# EasyEDA Pro project ProProject_高频电路震荡器_2024-07-08.epro

# Schematic Schematic1
Create Date: 2024-06-09; Page Name: P1; Project Name: 高频电路震荡器; Schematic Name: Schematic1; Update Date: 2024-06-09; Company: 嘉立创EDA; Page Size: A4; Version: V1.0
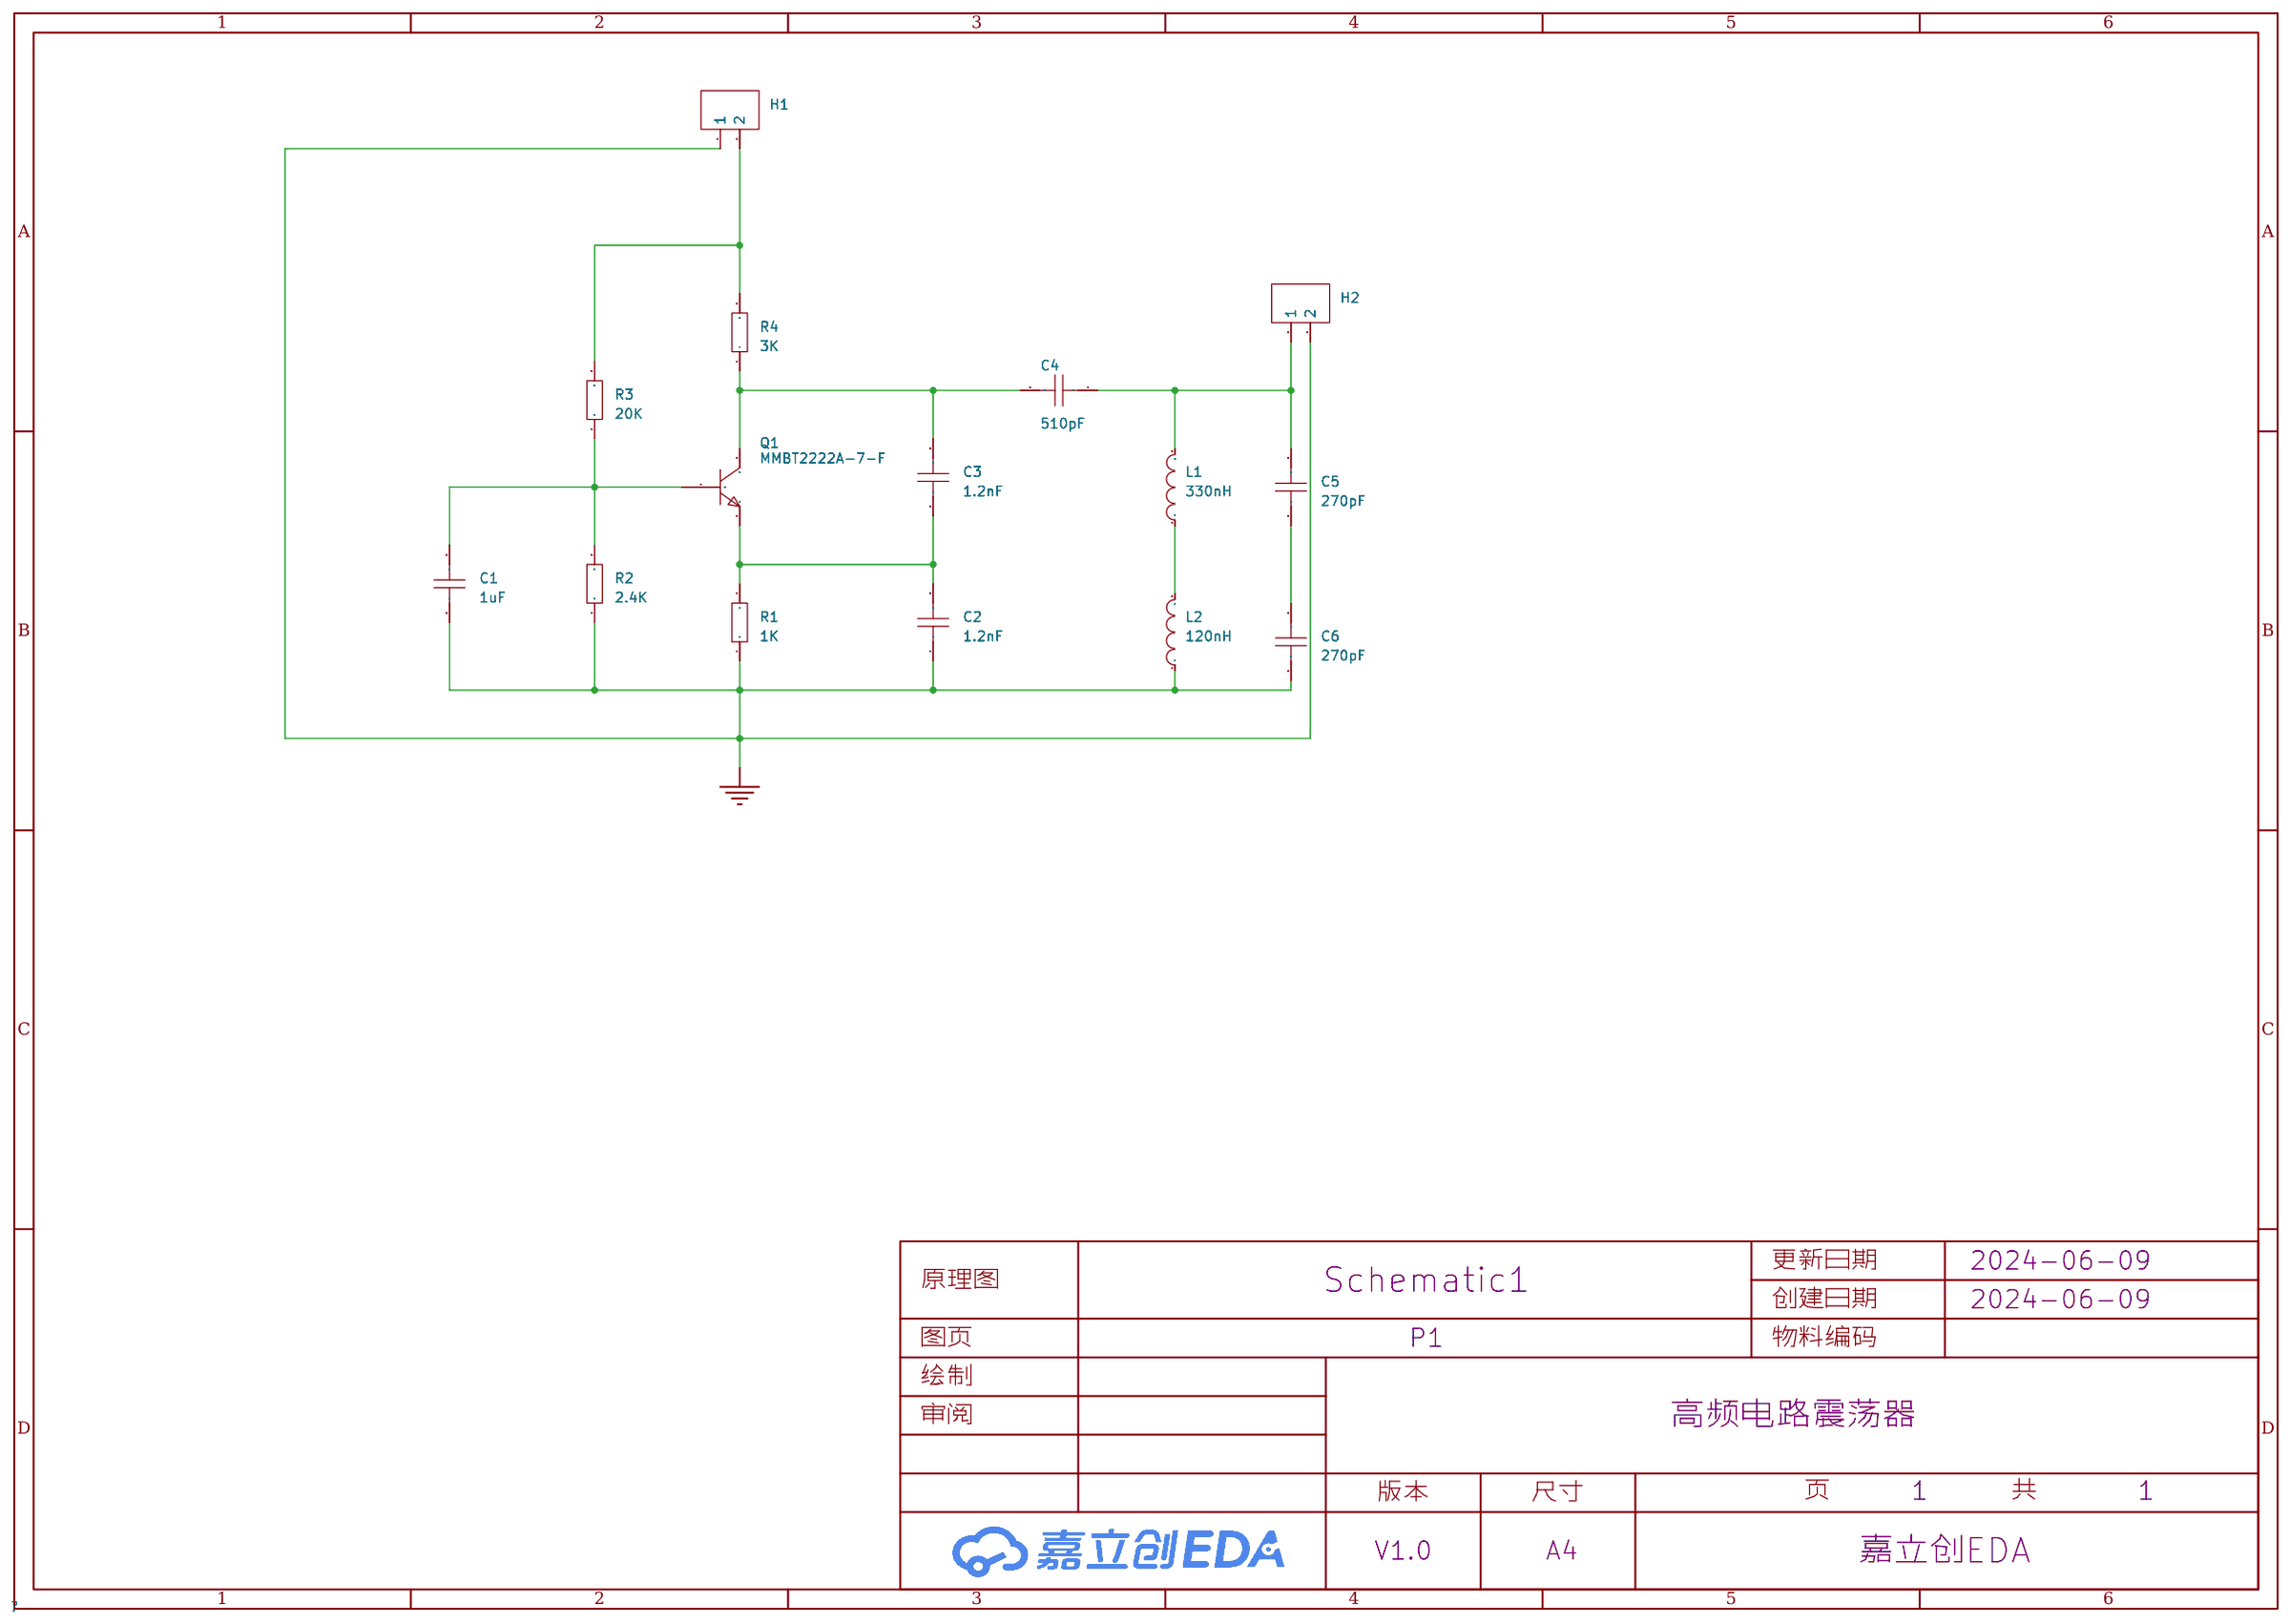
[diagram p0: schematic sheet]

## Parts
C1  1uF  [C0805]
C2  1.2nF  [C0805]
C3  1.2nF  [C0805]
C4  510pF  [C0805]
C5  270pF  [C0805]
C6  270pF  [C0805]
H1  -  [HDR-TH_2P-P2.54-V-F]
H2  -  [HDR-TH_2P-P2.54-V-F]
L1  330nH  [L0805]
L2  120nH  [L0805]
Q1  MMBT2222A-7-F  [SOT-23-3_L2.9-W1.6-P1.90-LS2.8-BR]
R1  1K  [R0805]
R2  2.4K  [R0805]
R3  20K  [R0805]
R4  3K  [R0805]

## Library data of the parts
C1-C6 = CAP_0805: Supplier Footprint: 0805
H1 H2 = HDR-F_2.54_1x2P: Supplier Part: C49661; Supplier Footprint: 插件
L1 L2 = L_0805
Q1 = MMBT2222A-7-F: 晶体管类型:NPN;集电极电流(Ic):600mA;集射极击穿电压(Vceo):40V;功率(Pd):310mW;直流电流增益(hFE@Ic,Vce):100@150mA,10V;; LCSC Part Name: 耐压:40V 电流:600mA NPN; Supplier Part: C94515; Manufacturer: DIODES(美台); Supplier Footprint: SOT-23; JLCPCB Part Class: 扩展库; Datasheet: https://atta.szlcsc.com/upload/public/pdf/source/20180307/C94515_15204091498191407767.pdf; Supplier: LCSC; Transistor Type: NPN; Collector Current (Ic): 600mA; Collector-Emitter Breakdown Voltage (Vceo): 40V; Power Dissipation (Pd): 310mW; DC Current Gain (hFE@Ic,Vce): 100@150mA,10V; Transition Frequency (fT): 300MHz; Collector Cut-Off Current (Icbo): 10nA; Collector-Emitter Saturation Voltage (VCE(sat)@Ic,Ib): 1V@500mA,50mA; Operating Temperature: -55℃~+150℃@(Tj)
R1-R4 = Res_0805: Supplier Footprint: 0805

## Nets
GND: C1.2 C2.1 C6.1 H1.1 H2.2 L2.1 R1.1 R2.1
Net-(C1-1): C1.1 Q1.1(B) R2.2 R3.1
Net-(C2-2): C2.2 C3.1 Q1.2(E) R1.2
Net-(C3-2): C3.2 C4.2 Q1.3(C) R4.1
Net-(C4-1): C4.1 C5.2 H2.1 L1.2
Net-(C5-1): C5.1 C6.2
Net-(H1-2): H1.2 R3.2 R4.2
Net-(L1-1): L1.1 L2.2

# Board PCB1
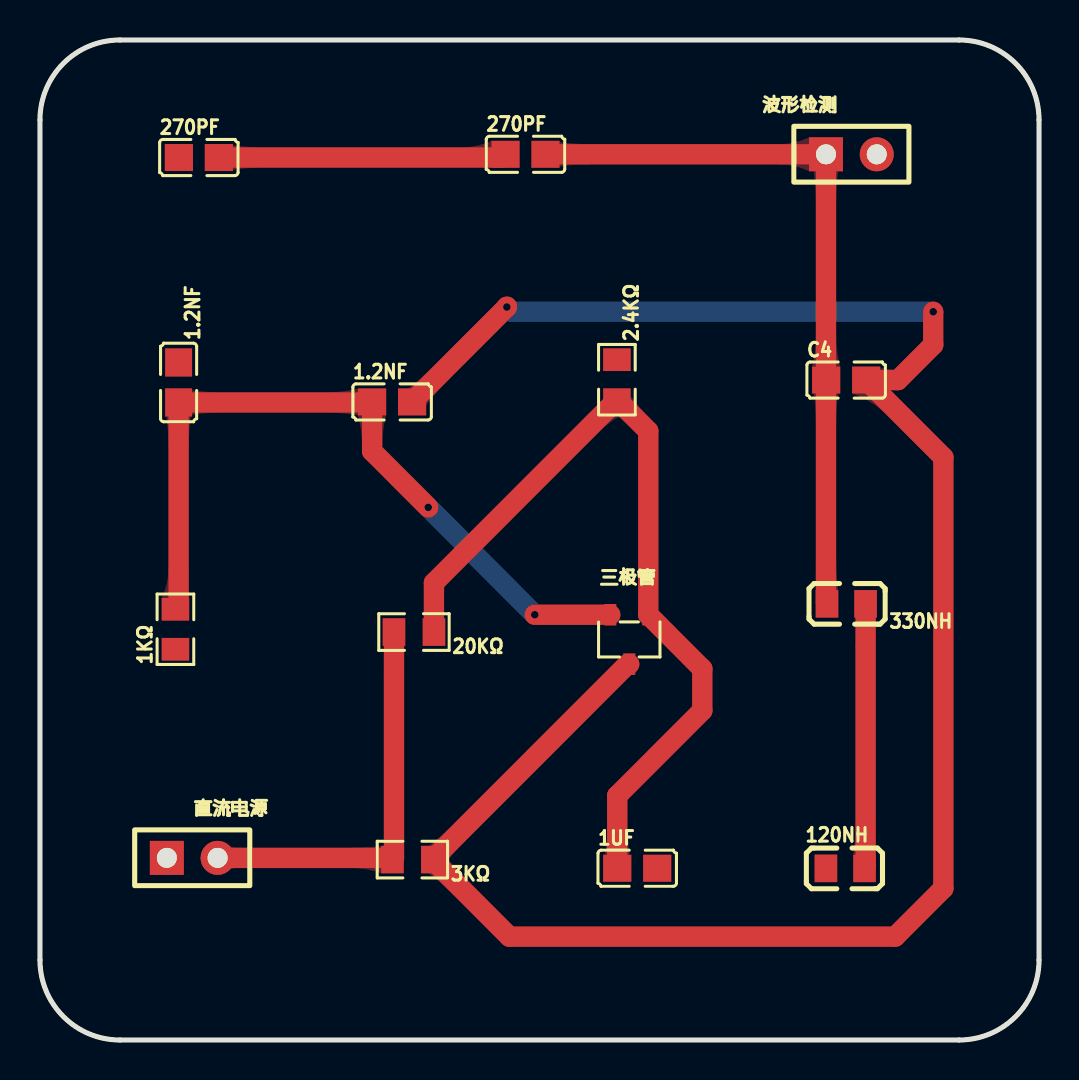
[diagram p1: board, top side]
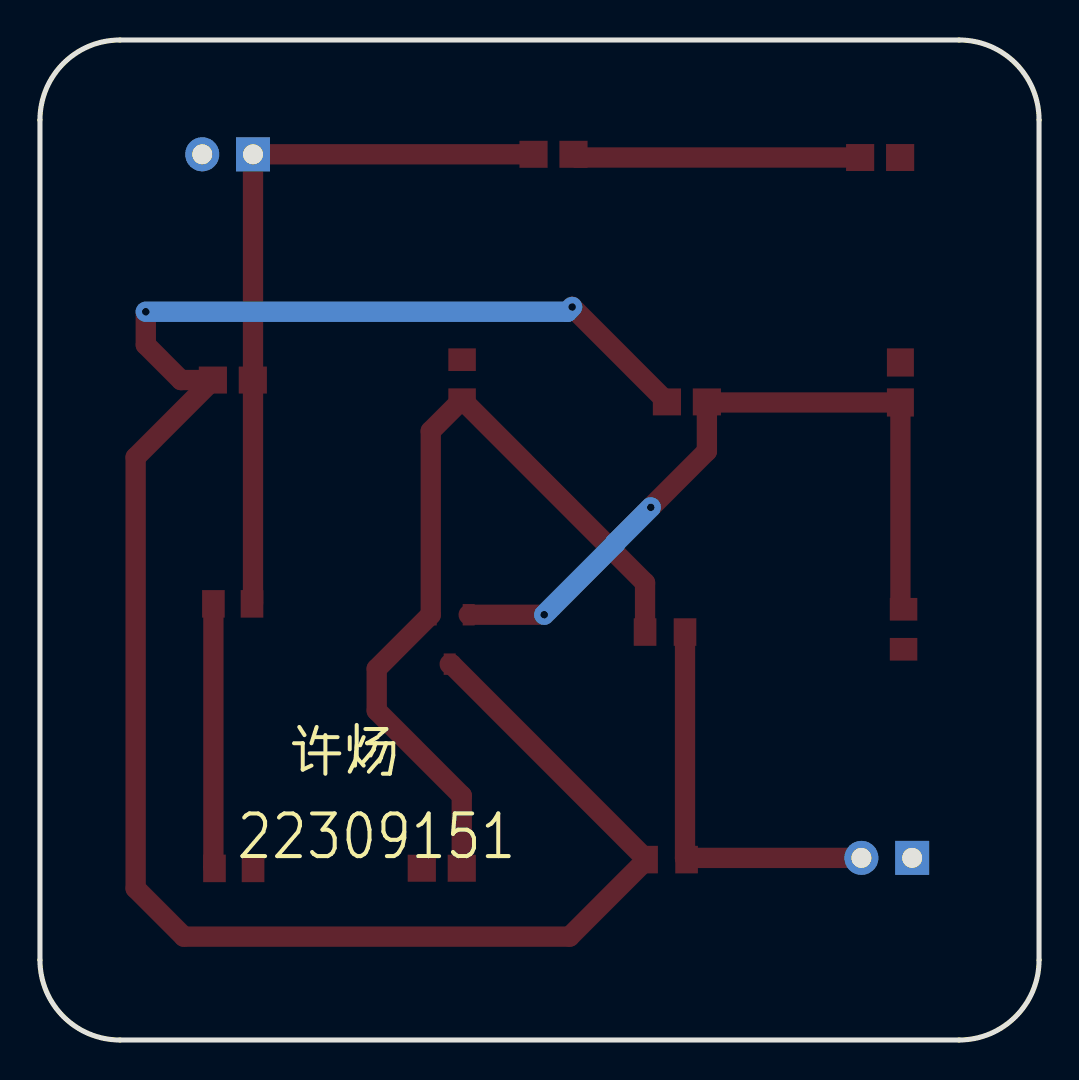
[diagram p2: board, bottom side, seen from below]

Outline 50 x 50 mm; copper layers: Top Layer, Bottom Layer. Coordinates in mm from the lower left corner of the outline.
Outline path: 0,46 0,4 arc(1.17,1.17) 4,0 46,0 arc(48.83,1.17) 50,4 50,46 arc(48.83,48.83) 46,50 4,50 arc(1.17,48.83) 0,46
Stack: Top Layer 0.035mm / Dielectric1 1.51mm FR4 er 4.5 / Bottom Layer 0.035mm

## Design rules (mm)
template: 自定义配置
spacing copperThickness1oz (default): track to track 0.102, other pairs 0.152 to 0.3
spacing copperThickness2oz: track to track 0.203, other pairs 0.152 to 0.3
track width copperThickness1oz (default): min 0.762, default 0.762, max 2.54
track width copperThickness2oz: min 0.203, default 0.254, max 2.54
differential pair differentialPair (default): width min 0.127, default 0.254, max 2.54; gap min 0.152, default 0.152
via viaSize (default): diameter min 0.5, default 0.61, max 10; hole min 0.3, default 0.305, max 6.299

## Placement (name value [footprint] x y rotation side)
1.2NF  -  [C0805]  17.62 31.9 0 top
1.2NF#2  -  [C0805]  6.94 32.88 270 top
1KΩ  1K  [R0805]  6.78 20.54 90 top
1UF  1uF  [C0805]  29.89 8.59 0 top
2.4KΩ  2.4K  [R0805]  28.87 33.02 270 top
3KΩ  3K  [R0805]  18.64 9.02 180 top
20KΩ  20K  [R0805]  18.72 20.4 180 top
120NH  120nH  [L0805]  40.3 8.58 0 top
270PF  -  [C0805]  24.3 44.29 0 top
270PF#2  -  [C0805]  7.95 44.12 0 top
330NH  330nH  [L0805]  40.35 21.81 180 top
C4  510pF  [C0805]  40.35 33 0 top
三极管  MMBT2222A-7-F  [SOT-23-3_L2.9-W1.6-P1.90-LS2.8-BR]  29.49 20.03 90 top
波形检测  -  [HDR-TH_2P-P2.54-V-F]  40.61 44.29 0 top
直流电源  -  [HDR-TH_2P-P2.54-V-F]  7.62 9.11 0 top

## Footprints (pads in the part's own frame, mm; a bottom-side part is the same pattern mirrored in y, then rotated)
C0805
  rect 1.41x1.35 smd: 1(-1,0) 2(1,0)
HDR-TH_2P-P2.54-V-F
  rect 1.7x1.7 hole 1: 1(-1.27,0)
  round 1.7 hole 1: 2(1.27,0)
L0805
  rect 1.133x1.377 smd: 1(-0.966,0) 2(0.966,0)
R0805
  rect 1.133x1.377 smd: 1(-1,0) 2(1,0)
SOT-23-3_L2.9-W1.6-P1.90-LS2.8-BR
  rect 1.07x0.6 smd: 1(1.235,-0.95) 2(1.235,0.95) 3(-1.235,0)

## Nets
GND: 1.2NF#2.1 1KΩ.1 1UF.2 2.4KΩ.1 120NH.1 270PF#2.1 波形检测.2 直流电源.1
$1N484: 120NH.2 330NH.1
$1N509: 270PF.1 270PF#2.2
$1N549: 1UF.1 2.4KΩ.2 20KΩ.1 三极管.1
$1N583: 1.2NF.2 3KΩ.1 C4.2 三极管.3
$1N694: 3KΩ.2 20KΩ.2 直流电源.2
$1N780: 270PF.2 330NH.2 C4.1 波形检测.1
$1N793: 1.2NF.1 1.2NF#2.2 1KΩ.2 三极管.2

## Via types
v1: diameter 0.762, hole 0.381, Top Layer to Bottom Layer, 4 vias

## Routing (per net, layer and track width the routed paths; a pad name or vN(x,y) marks a point on that pad's centre or on a via; arc(x,y) is an arc through that point)
$1N484: length 13.2
  Top Layer w1.016: 41.32,21.81 41.32,8.63 120NH.2
$1N509: length 14.4
  Top Layer w1.016: 270PF#2.2 23.14,44.12 270PF.1
$1N549: length 42.4
  Top Layer w1.016: 20KΩ.1 19.72,22.86 2.4KΩ.2 30.44,30.45 三极管.1 33.15,18.56 33.15,16.47 28.89,12.22 1UF.1
$1N583: length 103
  Top Layer w1.016: 1.2NF.2 v1(23.37,36.65) 23.37,36.67 ; 三极管.3 29.41,18.79 3KΩ.1 23.49,5.17 42.8,5.17 45.21,7.58 45.21,29.13 C4.2 42.94,33 44.7,34.76 v1(44.7,36.41)
  Bottom Layer w1.016: v1(23.37,36.65) 23.61,36.41 v1(44.7,36.41)
$1N694: length 20.2
  Top Layer w1.016: 直流电源.2 17.55,9.11 3KΩ.2 17.72,9.1 20KΩ.2
$1N780: length 36.5
  Top Layer w1.016: 39.34,33.01 39.34,44.29 270PF.2 ; 39.34,33.01 C4.1 ; 39.34,33.01 39.34,21.86 330NH.2
$1N793: length 37.9
  Top Layer w1.016: 三极管.2 v1(24.77,21.26) ; 1KΩ.2 6.94,21.7 1.2NF#2.2 16.6,31.88 1.2NF.1 16.62,29.44 v1(19.43,26.63)
  Bottom Layer w1.016: v1(24.77,21.26) 21.21,24.82 21.21,24.85 v1(19.43,26.63)

## Copper pours and planes (outline as drawn; the poured copper is in the pictures)
GND on Top Layer: -4.95,55.97 61.85,55.97 61.85,-4.74 -4.95,-4.74
GND on Bottom Layer: -11.94,54.7 78.74,54.7 78.74,-8.17 -11.94,-8.17

Small or netless copper shapes (teardrops, artwork), in the pictures only: 30 on Top Layer

## Text on the board
Bottom Silkscreen Layer: 22309151 | 许炀
